# Altium schematic sheet CHILD_BOARD.SchDoc
size D; SheetNumber: 1; SheetTotal: 11
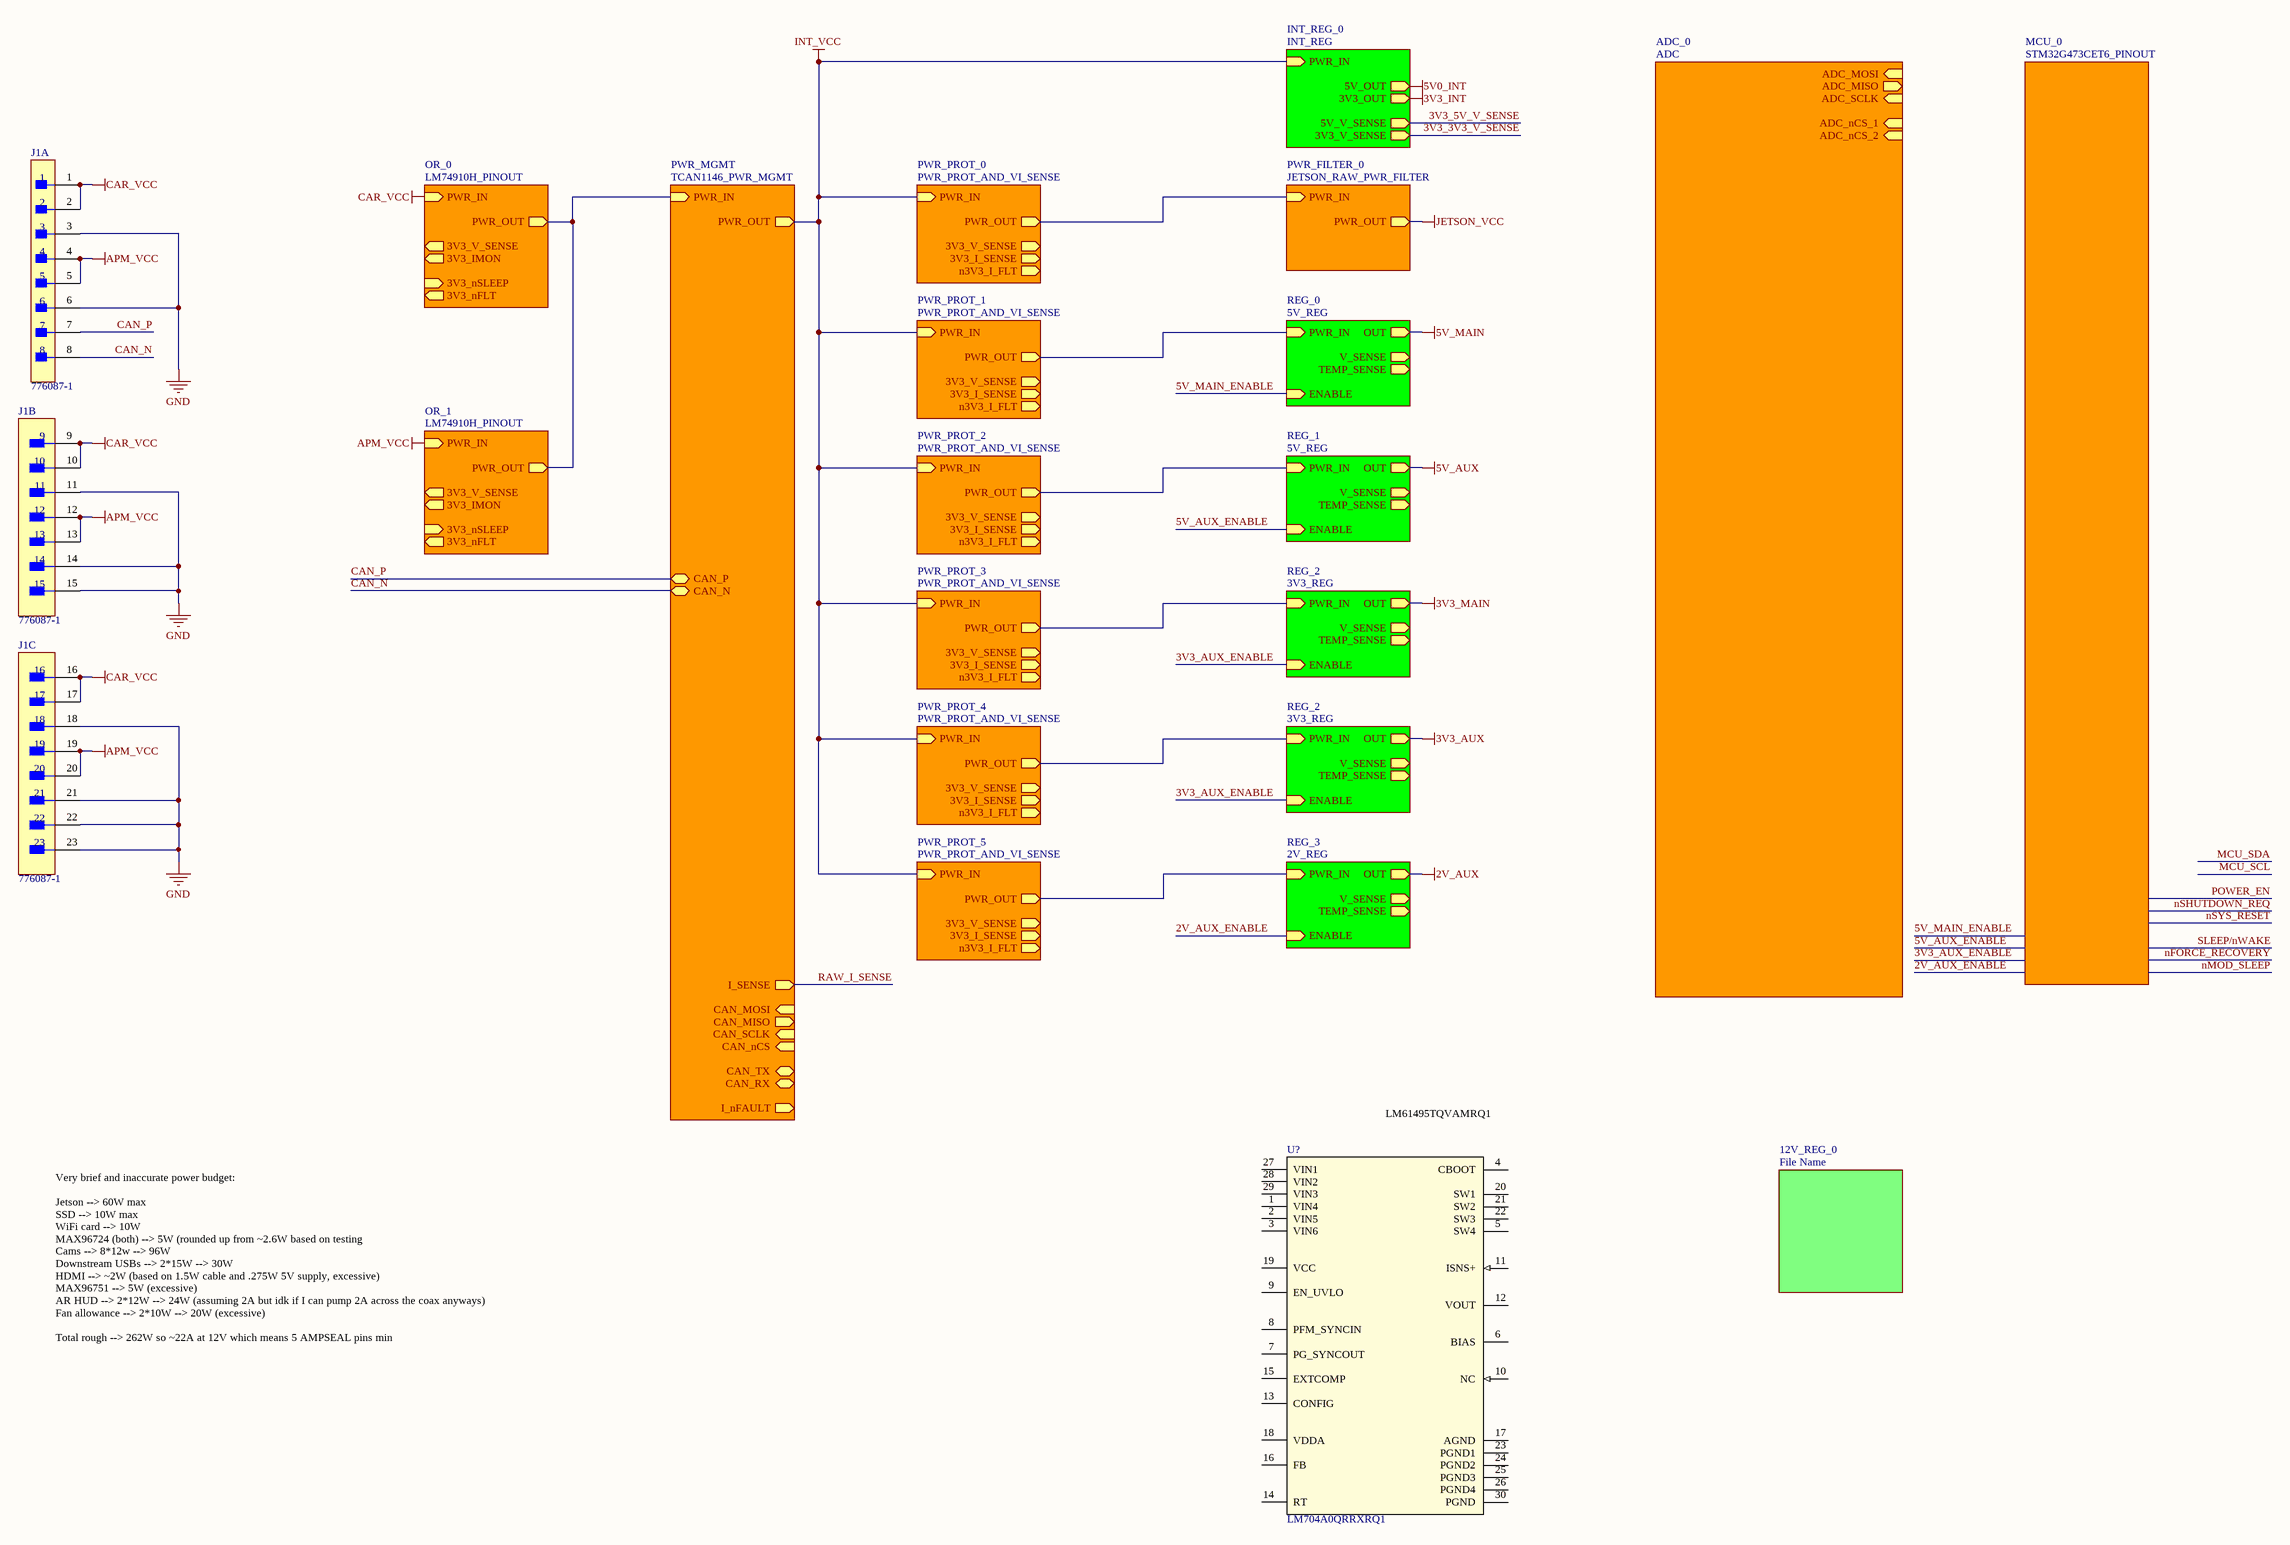
[diagram p0: CHILD_BOARD.SchDoc]

## Parts
J1  776087-1  [FP-776087-1-MFG]  (parts A,B,C of 3)
U?  LM704A0QRRXRQ1  [LM704A0QRRXRQ1-Footprint-1]

## Sub-sheets
12V_REG_0 = File Name: no entries
ADC_0 = ADC: ADC_SCLK (in), ADC_MISO (out), ADC_MOSI (in), ADC_nCS_1 (in), ADC_nCS_2 (in)
INT_REG_0 = INT_REG: PWR_IN (in), 5V_OUT (out), 3V3_OUT (out), 5V_V_SENSE (out), 3V3_V_SENSE (out)
MCU_0 = STM32G473CET6_PINOUT: no entries
OR_0 = LM74910H_PINOUT: PWR_IN (in), PWR_OUT (out), 3V3_nFLT (out), 3V3_nSLEEP (in), 3V3_IMON (out), 3V3_V_SENSE (out)
OR_1 = LM74910H_PINOUT: PWR_IN (in), PWR_OUT (out), 3V3_nFLT (out), 3V3_nSLEEP (in), 3V3_IMON (out), 3V3_V_SENSE (out)
PWR_FILTER_0 = JETSON_RAW_PWR_FILTER: PWR_IN (in), PWR_OUT (out)
PWR_MGMT = TCAN1146_PWR_MGMT: PWR_IN (in), PWR_OUT (out), CAN_MOSI (in), CAN_MISO (out), CAN_SCLK (in), CAN_nCS (in), CAN_TX (bidir), CAN_RX (bidir), I_SENSE (out), I_nFAULT (out), CAN_P (bidir), CAN_N (bidir)
PWR_PROT_0 = PWR_PROT_AND_VI_SENSE: PWR_IN (in), PWR_OUT (out), 3V3_V_SENSE (out), 3V3_I_SENSE (out), n3V3_I_FLT (out)
PWR_PROT_1 = PWR_PROT_AND_VI_SENSE: PWR_IN (in), PWR_OUT (out), 3V3_V_SENSE (out), 3V3_I_SENSE (out), n3V3_I_FLT (out)
PWR_PROT_2 = PWR_PROT_AND_VI_SENSE: PWR_IN (in), PWR_OUT (out), 3V3_V_SENSE (out), 3V3_I_SENSE (out), n3V3_I_FLT (out)
PWR_PROT_3 = PWR_PROT_AND_VI_SENSE: PWR_IN (in), PWR_OUT (out), 3V3_V_SENSE (out), 3V3_I_SENSE (out), n3V3_I_FLT (out)
PWR_PROT_4 = PWR_PROT_AND_VI_SENSE: PWR_IN (in), PWR_OUT (out), 3V3_V_SENSE (out), 3V3_I_SENSE (out), n3V3_I_FLT (out)
PWR_PROT_5 = PWR_PROT_AND_VI_SENSE: PWR_IN (in), PWR_OUT (out), 3V3_V_SENSE (out), 3V3_I_SENSE (out), n3V3_I_FLT (out)
REG_0 = 5V_REG: PWR_IN (in), OUT (out), V_SENSE (out), ENABLE (in), TEMP_SENSE (out)
REG_1 = 5V_REG: OUT (out), PWR_IN (in), ENABLE (in), V_SENSE (out), TEMP_SENSE (out)
REG_2 = 3V3_REG: PWR_IN (in), OUT (out), V_SENSE (out), ENABLE (in), TEMP_SENSE (out)
REG_2 = 3V3_REG: PWR_IN (in), OUT (out), V_SENSE (out), ENABLE (in), TEMP_SENSE (out)
REG_3 = 2V_REG: PWR_IN (in), OUT (out), V_SENSE (out), ENABLE (in), TEMP_SENSE (out)

## Nets
2V_AUX: sheet REG_3/OUT
3V3_AUX: sheet REG_2/OUT
3V3_INT: sheet INT_REG_0/3V3_OUT
3V3_MAIN: sheet REG_2/OUT
5V0_INT: sheet INT_REG_0/5V_OUT
5V_AUX: sheet REG_1/OUT
5V_MAIN: sheet REG_0/OUT
APM_VCC: J1.4 J1.5 J1.12 J1.13 J1.19 J1.20 ; sheet OR_1/PWR_IN
CAR_VCC: J1.1 J1.2 J1.9 J1.10 J1.16 J1.17 ; sheet OR_0/PWR_IN
GND: J1.3 J1.6 J1.11 J1.14 J1.15 J1.18 J1.21 J1.22 J1.23
INT_VCC: sheet PWR_MGMT/PWR_OUT, sheet PWR_PROT_0/PWR_IN, sheet INT_REG_0/PWR_IN, sheet PWR_PROT_1/PWR_IN, sheet PWR_PROT_2/PWR_IN, sheet PWR_PROT_3/PWR_IN, sheet PWR_PROT_4/PWR_IN, sheet PWR_PROT_5/PWR_IN
JETSON_VCC: sheet PWR_FILTER_0/PWR_OUT
2V_AUX_ENABLE: sheet REG_3/ENABLE
3V3_3V3_V_SENSE: sheet INT_REG_0/3V3_V_SENSE
3V3_5V_V_SENSE: sheet INT_REG_0/5V_V_SENSE
3V3_AUX_ENABLE: sheet REG_2/ENABLE, sheet REG_2/ENABLE
5V_AUX_ENABLE: sheet REG_1/ENABLE
5V_MAIN_ENABLE: sheet REG_0/ENABLE
CAN_N: J1.8 ; sheet PWR_MGMT/CAN_N
CAN_P: J1.7 ; sheet PWR_MGMT/CAN_P
RAW_I_SENSE: sheet PWR_MGMT/I_SENSE
(unnamed): sheet PWR_MGMT/PWR_IN, sheet OR_0/PWR_OUT, sheet OR_1/PWR_OUT
(unnamed): sheet PWR_PROT_0/PWR_OUT, sheet PWR_FILTER_0/PWR_IN
(unnamed): sheet REG_0/PWR_IN, sheet PWR_PROT_1/PWR_OUT
(unnamed): sheet REG_2/PWR_IN, sheet PWR_PROT_3/PWR_OUT
(unnamed): sheet REG_1/PWR_IN, sheet PWR_PROT_2/PWR_OUT
(unnamed): sheet REG_3/PWR_IN, sheet PWR_PROT_5/PWR_OUT
(unnamed): sheet REG_2/PWR_IN, sheet PWR_PROT_4/PWR_OUT

Not connected (* = marked no-connect by the designer): U? 1(VIN4) 2(VIN5) 3(VIN6) 4(CBOOT) 5(SW4) 6(BIAS) 7(PG_SYNCOUT) 8(PFM_SYNCIN) 9(EN_UVLO) 10(NC) 11(ISNS+) 12(VOUT) 13(CONFIG) 14(RT) 15(EXTCOMP) 16(FB) 17(AGND) 18(VDDA) 19(VCC) 20(SW1) 21(SW2) 22(SW3) 23(PGND1) 24(PGND2) 25(PGND3) 26(PGND4) 27(VIN1) 28(VIN2) 29(VIN3) 30(PGND)

## Notes on the sheet
- LM61495TQVAMRQ1
- Very brief and inaccurate power budget:
  Jetson --> 60W max
  SSD --> 10W max
  WiFi card --> 10W
  MAX96724 (both) --> 5W (rounded up from ~2.6W based on testing
  Cams --> 8*12w --> 96W
  Downstream USBs --> 2*15W --> 30W
  HDMI --> ~2W (based on 1.5W cable and .275W 5V supply, excessive)
  MAX96751 --> 5W (excessive)
  AR HUD --> 2*12W --> 24W (assuming 2A but idk if I can pump 2A across the coax anyways)
  Fan allowance --> 2*10W --> 20W (excessive)
  Total rough --> 262W so ~22A at 12V which means 5 AMPSEAL pins min

## Library data of the parts
J1 = CMP-03369-000157-2: CONN HEADER R/A 23POS 4MM; Max Voltage Rating (AC): 250V; PCB Thickness: 0.062inch; PCB Mount Alignment: Yes (With); Primary Type: Rectangular; Number of Signal Positions: 23; Row Spacing: 0.157inch; Current Rating: 17A; Connector System: Wire-to-Device; Number of Ports: 1; Shielding: Unshielded; PCB Mount Retention: With; Circuit Application: Power; Tab Thickness: 1.3mm; Gender: Male; Contact Shape: Circular; Mount: Through Hole; ELV: Compliant; Orientation: Right Angle; Lead Free: Lead Free; Contact Plating: Tin; Package Quantity: 1; RoHS Compliant: Yes; Connector Type: Header; Series: Ampseal; Termination: Solder; Voltage Rating (AC): 250V; Contact Material: Brass; Number of Rows: 3; Depth: 37.9mm; Housing Material: Polybutylene; Fastening Type: Ramp; Width: 37.9mm; Flammability Rating: UL94 V-0; Housing Color: Black; Radiation Hardening: No; Contact Type: Male Pin; Sealable: Yes (With); Length: 60.8mm; Max Operating Temperature: 221°C; Packaging: Bulk; Number of Positions: 23; Insulation Material: PBT; Pitch: 0.157inch; Contact Finish - Mating: TIN; Color: Black; Number of Terminals/Pins: 23; Insulation Color: Black; Number of Contacts: 23; Min Operating Temperature: -40°C
U? = CMP-019-00058-1: Automotive, High-density, 4.5V to 45V input, 10A low-EMI synchronous DC/DC step-down converter 29-VQFN -40 to 150; Case/Package: VQFN; Pins: 29